# EAGLE schematic sdunit (EAGLE 6.5.0)
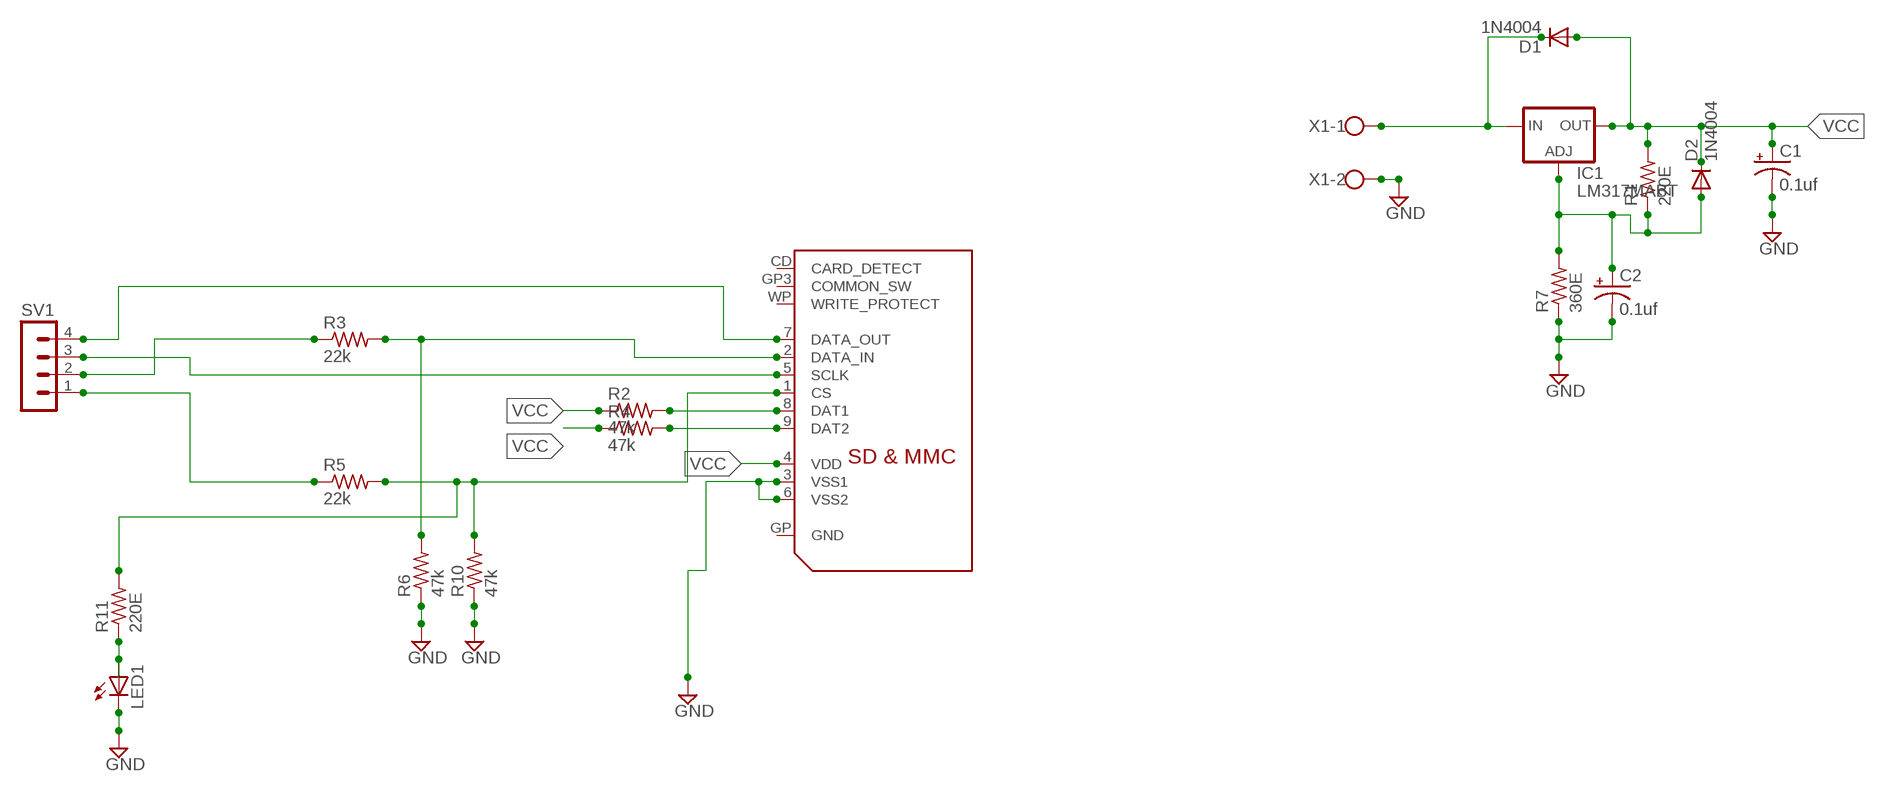
[diagram p0: schematic, sheet 1]

## Parts
C1  0.1uf  CPOL-USE5-4  [E5-4]
C2  0.1uf  CPOL-USE5-4  [E5-4]
D1  1N4004  [DO41-10]
D2  1N4004  [DO41-10]
IC1  LM317MABT  [TO220L1]
LED1  LED3MM  [LED3MM]
R1  220E  R-US_0207/10  [0207/10]
R2  47k  R-US_0207/10  [0207/10]
R3  22k  R-US_0207/10  [0207/10]
R4  47k  R-US_0207/10  [0207/10]
R5  22k  R-US_0207/10  [0207/10]
R6  47k  R-US_0207/10  [0207/10]
R7  360E  R-US_0207/10  [0207/10]
R10  47k  R-US_0207/10  [0207/10]
R11  220E  R-US_0207/10  [0207/10]
SV1  MA04-1  [MA04-1]
U$1  SDMMC06132  [06132]
X1  W237-102  [W237-102]

## Nets
GND: C1.- C2.- LED1.K(C) R6.1 R7.1 R10.1 X1.2
N$1: D1.C IC1.3(IN) X1.1
N$2: LED1.A R11.1
N$3: C2.+ D2.A IC1.1(ADJ) R1.1 R7.2
N$4: R3.1 SV1.2
N$5: SV1.4 U$1.7(DATA_OUT)
N$6: SV1.3 U$1.5(SCLK)
N$7: R3.2 R6.2 U$1.2(DATA_IN)
N$10: R5.1 SV1.1
N$11: R5.2 R10.2 R11.2 U$1.1(CS)
N$12: R2.2 U$1.8(DAT1)
N$13: R4.2 U$1.9(DAT2)
VCC: C1.+ D1.A D2.C IC1.2(OUT) R1.2 R2.1 R4.1 U$1.4(VDD)
VSS1: U$1.3(VSS1) U$1.6(VSS2) ; supply symbol labelled GND
Unconnected: U$1.CD(CARD_DETECT) U$1.GP3(COMMON_SW) U$1.GP(GND) U$1.WP(WRITE_PROTECT)

## Library data of the parts
C1 C2 = rcl:CPOL-US: POLARIZED CAPACITOR, American symbol
D1 D2 = diode:1N4004: DIODE general purpose rectifier, 1 A
IC1 = v-reg:LM317?*: 500 mA Adjustable Output Positive Voltage Regulator Source: http://www.onsemi.co.jp .. LM317M-D.PDF
LED1 = adafruit:LED: LED OSRAM: - CHIPLED LG R971, LG N971, LY N971, LG Q971, LY Q971, LO R971, LY R971 LH N974, LH R974 LS Q976, LO Q976, LY Q976 LO Q996 - Hyper CHIPLED LW Q18S LB Q993, LB Q99A, LB R99A - SideLED LS A670, LO A670, LY A670, LG A670, LP A670 LB A673, LV A673, LT A673, LW A673 LH A674 LY A675 LS A676, LA A676, LO A676, LY A676, LW A676 LS A679, LY A679, LG A679 - Hyper Micro SIDELED® LS Y876, LA Y876, LO Y876, LY Y876 LT Y87S - SmartLED LW L88C, LW L88S LB L89C, LB L89S, LG L890 LS L89K, LO L89K, LY L89K LS L896, LA L896, LO L896, LY L896 - TOPLED LS T670, LO T670, LY T670, LG T670, LP T670 LSG T670, LSP T670, LSY T670, LOP T670, LYG T670 LG T671, LOG T671, LSG T671 LB T673, LV T673, LT T673, LW T673 LH T674 LS T676, LA T676, LO T676, LY T676, LB T676, LH T676, LSB T676, LW T676 LB T67C, LV T67C, LT T67C, LS T67K, LO T67K, LY T67K, LW E67C LS E67B, LA E67B, LO E67B, LY E67B, LB E67C, LV E67C, LT E67C LW T67C LS T679, LY T679, LG T679 LS T770, LO T770, LY T770, LG T770, LP T770 LB T773, LV T773, LT T773, LW T773 LH T774 LS E675, LA E675, LY E675, LS T675 LS T776, LA T776, LO T776, LY T776, LB T776 LHGB T686 LT T68C, LB T68C - Hyper Mini TOPLED® LB M676 - Mini TOPLED Santana® LG M470 LS M47K, LO M47K, LY M47K Source: http://www.osram.convergy.de/
R1-R7 R10 R11 = rcl:R-US_: RESISTOR, American symbol
SV1 = con-lstb:MA04-1: PIN HEADER; OC_FARNELL: unknown; OC_NEWARK: unknown
U$1 = adafruit:SDMMC: SD MMC Card holder 4UCON part #06132 - easy to solder
X1 = con-wago-500:W237-102: WAGO SCREW CLAMP; MPN: 237-102; OC_FARNELL: unknown; OC_NEWARK: 70K9898